# Altium schematic sheet POWER.SchDoc
size A4
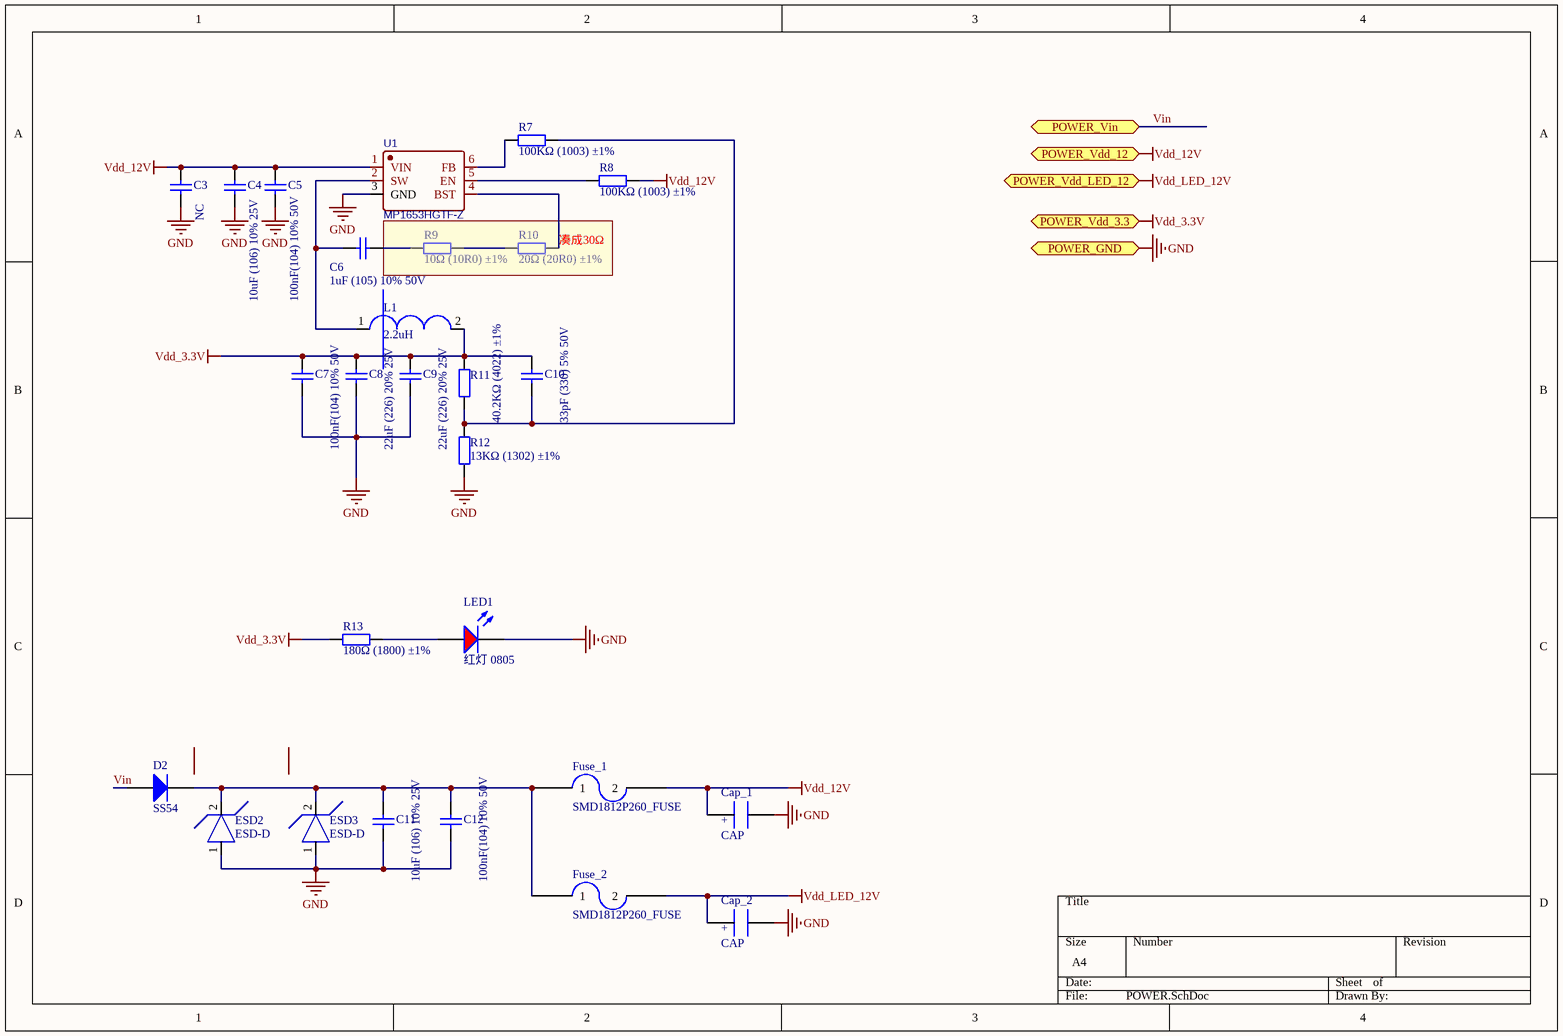
[diagram p0: POWER.SchDoc]

## Parts
C3  NC  [0805_C]
C4  10uF (106) 10% 25V  [0805_C]
C5  100nF(104) 10% 50V  [0805_C]
C6  1uF (105) 10% 50V  [0805_C]
C7  100nF(104) 10% 50V  [0805_C]
C8  22uF (226) 20% 25V  [0805_C]
C9  22uF (226) 20% 25V  [0805_C]
C10  33pF (330) 5% 50V  [0805_C]
C11  10uF (106) 10% 25V  [0805_C]
C12  100nF(104) 10% 50V  [0805_C]
Cap_1  CAP  [8X12_CAP]
Cap_2  CAP  [8X12_CAP]
D2  SS54  [SMA(DO-214AC)_S1]
ESD2  ESD-D  [SOD-523]
ESD3  ESD-D  [SOD-523]
Fuse_1  SMD1812P260_FUSE  [SMD1812P260]
Fuse_2  SMD1812P260_FUSE  [SMD1812P260]
L1  2.2uH  [L_4030]
LED1  红灯 0805  [0805_LED_S1]
R7  100KΩ (1003) ±1%  [0805_R]
R8  100KΩ (1003) ±1%  [0805_R]
R9  10Ω (10R0) ±1%  [0805_R]
R10  20Ω (20R0) ±1%  [0805_R]
R11  40.2KΩ (4022) ±1%  [0805_R]
R12  13KΩ (1302) ±1%  [0805_R]
R13  180Ω (1800) ±1%  [0805_R]
U1  MP1653HGTF-Z  [SOT563-6]

## Blocks framed on the sheet
凑成30Ω: R9 R10

## Ports
POWER_GND, POWER_Vdd_3.3, POWER_Vdd_12, POWER_Vdd_LED_12, POWER_Vin

## Nets
GND: C3.1 C4.1 C5.1 C7.1 C8.1 C9.1 C11.1 C12.1 Cap_1.2 Cap_2.2 ESD2.1 ESD3.1 LED1.K R12.1 U1.3(GND) ; port POWER_GND
Vdd_3.3V: C7.2 C8.2 C9.2 C10.2 L1.2 R11.1 R13.1 ; port POWER_Vdd_3.3
Vdd_12V: C3.2 C4.2 C5.2 Cap_1.1 Fuse_1.2 R8.2 U1.1(VIN) ; port POWER_Vdd_12
Vdd_LED_12V: Cap_2.1 Fuse_2.2 ; port POWER_Vdd_LED_12
Vin: D2.1(A) ; port POWER_Vin
NetC6_1: C6.1 R9.2
NetC6_2: C6.2 L1.1 U1.2(SW)
NetC10_1: C10.1 R7.2 R11.2 R12.2
NetC11_2: C11.2 C12.2 D2.2(K) ESD2.2 ESD3.2 Fuse_1.1 Fuse_2.1
NetLED1_A: LED1.A R13.2
NetR7_1: R7.1 U1.6(FB)
NetR8_1: R8.1 U1.5(EN)
NetR9_1: R9.1 R10.2
NetR10_1: R10.1 U1.4(BST)

## Notes on the sheet
- (in symbol CAP) +

## Library data of the parts
C3 C4 C11 = 0805 10uF (106) 10% 25V: 贴片电容; ComponentLink1Description: 供应商链接; ComponentLink1URL: http://www.szlcsc.com/product/details_16532.html; Package: 0805; Supplier: LC; SuppliersPartNumber: C15850
C5 C7 C12 = 0805 100nF(104) 10% 50V: 贴片电容; ComponentLink1Description: 供应商链接; ComponentLink1URL: http://www.szlcsc.com/product/details_50686.html; Package: 0805; Supplier: LC; SuppliersPartNumber: C49678
C6 = 0805 1uF (105) 10% 50V: 贴片电容; ComponentLink1Description: 供应商链接; ComponentLink1URL: http://www.szlcsc.com/product/details_29074.html; Package: 0805; Supplier: LC; SuppliersPartNumber: C28323
C8 C9 = 0805 22uF (226) 20% 25V: 贴片电容; ComponentLink1Description: 供应商链接; ComponentLink1URL: http://www.szlcsc.com/product/details_46786.html; Package: 0805; Supplier: LC; SuppliersPartNumber: C45783
C10 = 0805 33pF (330) 5% 50V: 贴片电容; ComponentLink1Description: 供应商链接; ComponentLink1URL: http://www.szlcsc.com/product/details_2166.html; Package: 0805; Supplier: LC; SuppliersPartNumber: C1814
D2 = SMA(DO-214AC) SS54: 二极管; ComponentLink1Description: 供应商链接; ComponentLink1URL: http://www.szlcsc.com/product/details_23178.html; Package: SMA(DO-214AC); Supplier: LC; SuppliersPartNumber: C22452
L1 = 33uH
LED1 = 0805 红灯: 发光二极管; ComponentLink1Description: 供应商链接; ComponentLink1URL: http://www.szlcsc.com/product/details_2668.html; Package: 0805; Supplier: LC; SuppliersPartNumber: C2295
R7 R8 = 0805 100KΩ (1003) 1%: 贴片电阻; ComponentLink1Description: 供应商链接; ComponentLink1URL: http://www.szlcsc.com/product/details_18095.html; Package: 0805; Supplier: LC; SuppliersPartNumber: C17407
R9 = 0805 10Ω (10R0) 1%: 贴片电阻; ComponentLink1Description: 供应商链接; ComponentLink1URL: http://www.szlcsc.com/product/details_18103.html; Package: 0805; Supplier: LC; SuppliersPartNumber: C17415
R10 = 0805 20Ω (20R0) 1%: 贴片电阻; ComponentLink1Description: 供应商链接; ComponentLink1URL: http://www.szlcsc.com/product/details_18232.html; Package: 0805; Supplier: LC; SuppliersPartNumber: C17544
R11 = 0805 40.2KΩ (4022) 1%: 贴片电阻; ComponentLink1Description: 供应商链接; ComponentLink1URL: http://www.szlcsc.com/product/details_18366.html; Package: 0805; Supplier: LC; SuppliersPartNumber: C17678
R12 = 0805 13KΩ (1302) 1%: 贴片电阻; ComponentLink1Description: 供应商链接; ComponentLink1URL: http://www.szlcsc.com/product/details_18143.html; Package: 0805; Supplier: LC; SuppliersPartNumber: C17455
R13 = 0805 180Ω (1800) 1%: 贴片电阻; ComponentLink1Description: 供应商链接; ComponentLink1URL: http://www.szlcsc.com/product/details_26013.html; Package: 0805; Supplier: LC; SuppliersPartNumber: C25270
U1 = MP1653HGTF-Z: BOM_Manufacturer: MPS; BOM_Supplier: LCSC; BOM_Manufacturer Part: MP1653HGTF-Z; BOM_Supplier Part: C132613; spicePre: U